# Altium schematic sheet FPGA_CLK_SUSPEND.SchDoc
size A
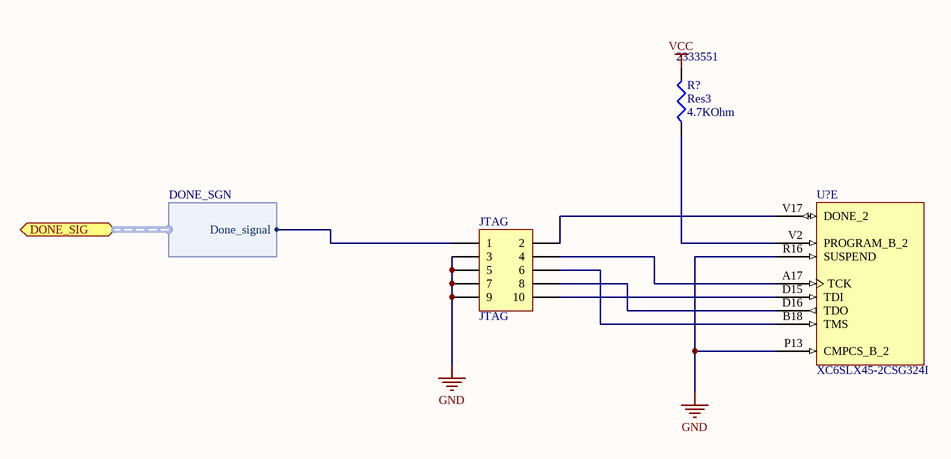
[diagram p0: FPGA_CLK_SUSPEND.SchDoc]

## Parts
JTAG  JTAG  [HDR2X5]
R?  Res3  value 4.7KOhm  Supplier Part Number 1: 2333551  [C1206]
U?  XC6SLX45-2CSG324I  [CSG324]  (part E of 8)

## Ports
DONE_SIG (harness DONE_SGN)

## Harnesses
DONE_SGN: Done_signal

## Nets
GND: JTAG.3 JTAG.5 JTAG.7 JTAG.9 U?.P13(CMPCS_B_2) U?.R16(SUSPEND)
VCC: R?.2
NetJTAG_1: JTAG.1 ; port DONE_SIG.Done_signal
NetJTAG_2: JTAG.2 U?.V17(DONE_2)
NetJTAG_4: JTAG.4 U?.A17(TCK)
NetJTAG_6: JTAG.6 U?.B18(TMS)
NetJTAG_8: JTAG.8 U?.D16(TDO)
NetJTAG_10: JTAG.10 U?.D15(TDI)
NetR?_1: R?.1 U?.V2(PROGRAM_B_2)

## Library data of the parts
JTAG = Header 5X2: Header, 5-Pin, Dual row; LatestRevisionDate: 17-Jul-2002; LatestRevisionNote: Re-released for DXP Platform.; Publisher: Altium Limited
R? = Res3: Resistor; Manufacturer: BOURNS; Manufacturer Part Number: CR1206-FX-4701ELF; Description: BOURNS - CR1206-FX-4701ELF - RESISTOR THICK FILM, 4.7KOHM, 1%, 1206; Product Range: BOURNS - CR Series; Resistance: 4.7; Power Rating: 250; Resistance Tolerance: ± 1%; Resistor Case Style: 1206 [3216 Metric]; Resistor Element Material: Thick Film; Temperature Coefficient: ± 100; Voltage Rating: 200; SVHC: No SVHC (16-Jun-2014; Published: 8-Jun-2000; LatestRevisionDate: 29-May-2009; LatestRevisionNote: IPC-7351 Footprint Added.; PackageReference: J1-0603; Publisher: Altium Limited; PackageDescription: Chip Resistor; Supplier 1: Farnell; RoHS: YES; Stock 1: 12041; Pricing 1: 1=0.453, 10=0.34, 50=0.278, 100=0.216, 500=0.1607, 1000=0.1339 (EUR); Packaging: Cut Tape; MSL: -; ComponentLink1URL: http://www.farnell.com/datasheets/691949.pdf; ComponentLink1Description: http://www.farnell.com/datasheets/691949.pdf
U? = CMP-0067-00402-1: Spartan-6 LX 1.2V FPGA, 218 User I/Os, 324-Ball Chip-Scale BGA (0.8mm Pitch), Speed Grade 2, Industrial Grade, Pb-Free; Code_JEDEC: MO-275-KKAC-1; PackageDescription: 324-Ball Chip-Scale BGA (CSG324) Package, 0.8 mm Pitch; DatasheetVersion: ver1.6, Nov-2010; PackageVersion: ver1.1, Nov-2009; PackageReference: CSG324